# Altium schematic sheet Driver3.SchDoc
size A4; SheetNumber: 5; SheetTotal: 8
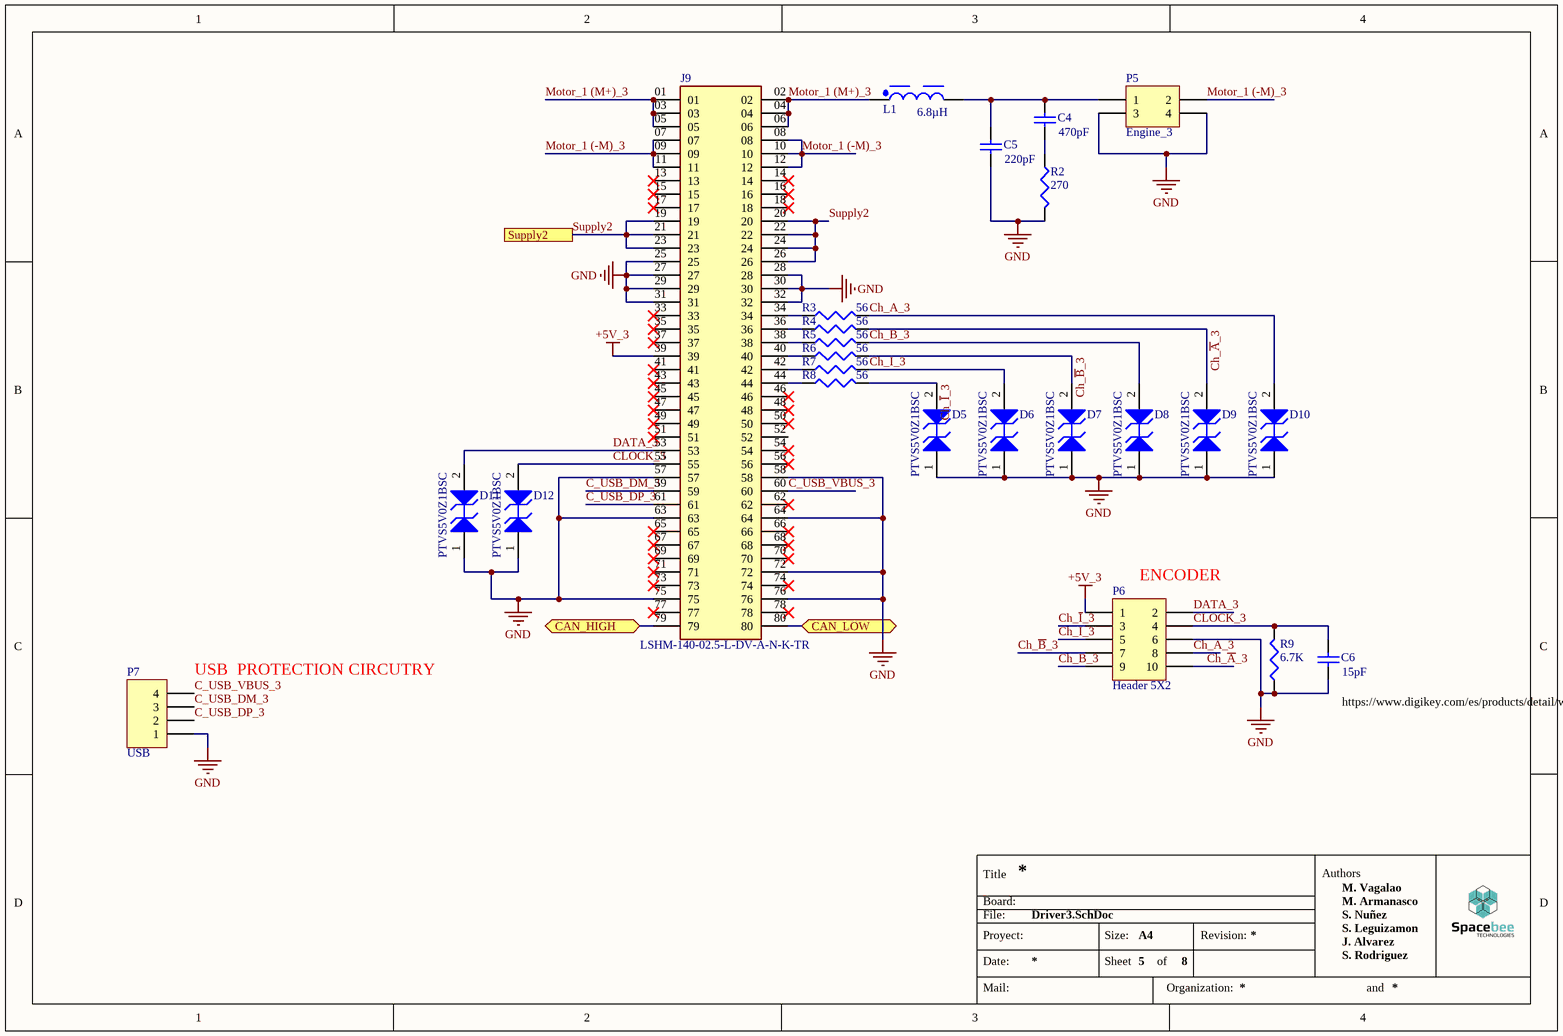
[diagram p0: Driver3.SchDoc]

## Parts
C4  value 470pF  [1608[0603]]  (hidden comment: Cap Semi)
C5  value 220pF  [1608[0603]]  (hidden comment: Cap Semi)
C6  value 15pF  [1608[0603]]  (hidden comment: Cap Semi)
D5  PTVS5V0Z1BSC  [SOD993B]
D6  PTVS5V0Z1BSC  [SOD993B]
D7  PTVS5V0Z1BSC  [SOD993B]
D8  PTVS5V0Z1BSC  [SOD993B]
D9  PTVS5V0Z1BSC  [SOD993B]
D10  PTVS5V0Z1BSC  [SOD993B]
D11  PTVS5V0Z1BSC  [SOD993B]
D12  PTVS5V0Z1BSC  [SOD993B]
J9  LSHM-140-02.5-L-DV-A-N-K-TR  [SAMTEC_LSHM-140-02.5-L-DV-A-N-K-TR]
L1  6.8µH  [WE-XHMA_6060]
P5  Engine_3  [MOLEX_1724480004]
P6  Header 5X2  [CONN_HIF3FC-14PA-2.54DS(71)_HIR]
P7  USB  [HDR1X4]
R2  value 270  [J1-0603]  (hidden comment: Res3)
R3  value 56  [J1-0603]  (hidden comment: Res3)
R4  value 56  [J1-0603]  (hidden comment: Res3)
R5  value 56  [J1-0603]  (hidden comment: Res3)
R6  value 56  [J1-0603]  (hidden comment: Res3)
R7  value 56  [J1-0603]  (hidden comment: Res3)
R8  value 56  [J1-0603]  (hidden comment: Res3)
R9  value 6.7K  [J1-0603]  (hidden comment: Res3)

## Ports
CAN_HIGH (bidir), CAN_LOW (bidir), Supply2

## Nets
+5V_3: J9.39 P6.1
GND: C5.2 C6.2 D5.1(A1) D6.1(A1) D7.1(A1) D8.1(A1) D9.1(A1) D10.1(A1) D11.1(A1) D12.1(A1) J9.25 J9.27 J9.28 J9.29 J9.30 J9.31 J9.32 J9.57 J9.58 J9.63 J9.64 J9.72 J9.75 J9.76 P5.3 P5.4 P6.6 P7.1 R2.2 R9.1
C_USB_DM_3: J9.59 P7.3
C_USB_DP_3: J9.61 P7.2
C_USB_VBUS_3: J9.60 P7.4
CAN_HIGH: J9.79 ; port CAN_HIGH
CAN_LOW: J9.80 ; port CAN_LOW
Ch_~{A}_3: D9.2(A2) P6.10 R4.2
Ch_A_3: D10.2(A2) P6.8 R3.2
Ch_~{B}_3: D7.2(A2) P6.7 R6.2
Ch_B_3: D8.2(A2) P6.9 R5.2
Ch_~{I}_3: D5.2(A2) P6.3 R8.2
Ch_I_3: D6.2(A2) P6.5 R7.2
CLOCK_3: C6.1 D12.2(A2) J9.55 P6.4 R9.2
DATA_3: D11.2(A2) J9.53 P6.2
Motor_1 (-M)_3: J9.07 J9.08 J9.09 J9.10 J9.11 J9.12 P5.2
Motor_1 (M+)_3: J9.01 J9.02 J9.03 J9.04 J9.05 J9.06 L1.1
Supply2: J9.19 J9.20 J9.21 J9.22 J9.23 J9.24 J9.26 ; port Supply2
NetC4_1: C4.1 C5.1 L1.2 P5.1
NetC4_2: C4.2 R2.1
NetJ9_34: J9.34 R3.1
NetJ9_36: J9.36 R4.1
NetJ9_38: J9.38 R5.1
NetJ9_40: J9.40 R6.1
NetJ9_42: J9.42 R7.1
NetJ9_44: J9.44 R8.1

Not connected (* = marked no-connect by the designer): J9 13* 14* 15* 16* 17* 18* 33* 35* 37* 41* 43* 45* 46* 47* 48* 49* 50* 51* 52 54* 56* 62* 65* 66* 67* 68* 69* 70* 71* 73* 74* 77* 78*

## Notes on the sheet
- (near P6) ENCODER
- (near P7) USB  PROTECTION CIRCUTRY
- (near C6) https://www.digikey.com/es/products/detail/würth-elektronik/9774050243R/5320640?s=N4IgTCBcDaIJwHYEBYAMBWVZkGYBKIAugL5A
- Title
- Board:
- File:
- Authors
- M. Armanasco
- S. Nuñez
- M. Vagalao
- Proyect:
- Date:
- Mail:
- Size:
- Sheet
- A4
- of
- Organization:
- Revision:
- S. Rodriguez
- S. Leguizamon
- J. Alvarez
- and

## Library data of the parts
C4-C6 = Cap Semi: Capacitor (Semiconductor SIM Model); Published: 8-Jun-2000; LatestRevisionDate: 29-May-2009; LatestRevisionNote: IPC-7351 Footprint Added.; PackageReference: C1206; Publisher: Altium Limited; PackageDescription: Chip Capacitor
D5-D12 = PTVS5V0Z1BSC: Manufacturer: On Semiconductor; PartNumber: 1SMB16CAT3; Direction: Bidirectional; IR Max (uA): 5; Packing: Tape and Reel; PPK Max (W): 600; V(BR) Typ (V): 18.74; DatasheetVersion: Rev. A; PackageVersion: Rev. A, 01/2000; PackageReference: SMB-2-403C-01; PackageDescription: 2-Pin Small Molded Package, J-Bend Lead, Body 4.315 x 3.555 mm; Supplier 1: Digi-Key; Supplier Part Number 1: 1SMB16CAT3OSTR-ND; Supplier 2: Digi-Key; Supplier Part Number 2: 1SMB16CAT3OSCT-ND; Supplier 3: Digi-Key; Supplier Part Number 3: 1SMB16CAT3OSDKR-ND; Mounting Technology: Surface Mount; ComponentLink1Description: Manufacturer URL; ComponentLink1URL: http://www.onsemi.com/; ComponentLink2Description: Datasheet; ComponentLink2URL: http://www.onsemi.com/pub_link/Collateral/1SMB10CAT3-D.PDF; ComponentLink3Description: Package Specification; ComponentLink3URL: http://www.onsemi.com/pub_link/Collateral/1SMB10CAT3-D.PDF
J9 = LSHM-140-02.5-L-DV-A-N-K-TR: LSHM - Samtec 0.50mm Razor Beam High-Speed Hermaphroditic Terminal / Socket Strip.; Price: None; MP: LSHM-140-02.5-L-DV-A-N-K-TR; Availability: Unavailable; Value: *; Package: None
L1 = 78439369068: WE-XHMA SMD Power Inductor, size 1090, 6.8µH, 10.5A, 7.16mΩ; Manufacturer: Wurth Elektronik; Case/Size Code: 1090; Inductance Tolerance: 20%; Saturation Current: 23.25A; Self Resonant Frequency: 16MHz; ComponentLink1Description: Website Link; ComponentLink1URL: https://www.we-online.com/redexpert/article/78439369068?ad; ComponentLink2Description: Datasheet Link; ComponentLink2URL: https://www.we-online.com/redexpert/spec/78439369068?ad; Manufacturer Part Number: 78439369068; Category: Shielded Power Inductors; Match Code: WE-XHMA; Mount: Surface Mount; Operating Temperature Max: 125°C; Operating Temperature Min: -40°C; Packaging: Tape and Reel; Length: 11.6mm; Width: 10.5mm; Height: 8.8mm; DC Resistance: 7.16mΩ; Inductance: 6.8µH; Rated Current: 10.5A
P5 = Header 2X2: Header, 2-Pin, Dual row; LatestRevisionDate: 17-Jul-2002; LatestRevisionNote: Re-released for DXP Platform.; Publisher: Altium Limited
P6 = Header 5X2: Header, 5-Pin, Dual row; LatestRevisionDate: 17-Jul-2002; LatestRevisionNote: Re-released for DXP Platform.; Publisher: Altium Limited
P7 = Header 4: Header, 4-Pin; LatestRevisionDate: 17-Jul-2002; LatestRevisionNote: Re-released for DXP Platform.; Publisher: Altium Limited
R2-R9 = Res3: Resistor; Published: 8-Jun-2000; LatestRevisionDate: 29-May-2009; LatestRevisionNote: IPC-7351 Footprint Added.; PackageReference: J1-0603; Publisher: Altium Limited; PackageDescription: Chip Resistor